# Altium schematic sheet 8_PCIeBank.SchDoc
size A; SheetNumber: 8; SheetTotal: 9
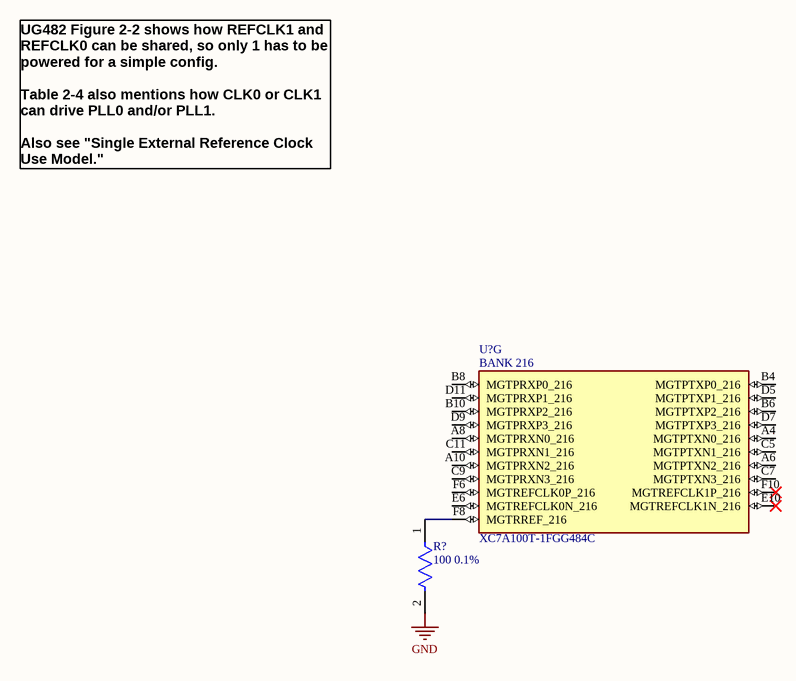
[diagram p0: 8_PCIeBank.SchDoc]

## Parts
R?  100 0.1%  [FP-ERA1A-IPC_B]
U?  XC7A100T-1FGG484C  [BGA484C100P22X22_2300X2300X260N]  (part G of 14)

## Nets
GND: R?.2
NetR?_1: R?.1 U?.F8(MGTRREF_216)

Not connected (* = marked no-connect by the designer): U? A4(MGTPTXN0_216) A6(MGTPTXN2_216) A8(MGTPRXN0_216) A10(MGTPRXN2_216) B4(MGTPTXP0_216) B6(MGTPTXP2_216) B8(MGTPRXP0_216) B10(MGTPRXP2_216) C5(MGTPTXN1_216) C7(MGTPTXN3_216) C9(MGTPRXN3_216) C11(MGTPRXN1_216) D5(MGTPTXP1_216) D7(MGTPTXP3_216) D9(MGTPRXP3_216) D11(MGTPRXP1_216) E6(MGTREFCLK0N_216) E10(MGTREFCLK1N_216)* F6(MGTREFCLK0P_216) F10(MGTREFCLK1P_216)*

## Notes on the sheet
- UG482 Figure 2-2 shows how REFCLK1 and REFCLK0 can be shared, so only 1 has to be powered for a simple config.
  Table 2-4 also mentions how CLK0 or CLK1 can drive PLL0 and/or PLL1.
  Also see "Single External Reference Clock Use Model."
- (in symbol XC7A100T-1FGG484C, part G) BANK 216

## Library data of the parts
R? = CMP-05422-000095-1: ERA-1AEB101C / RES SMD 100 OHM 0.1% 1/20W 0201; Max Power Dissipation: 50mW; Resistance: 100R; Temperature Coefficient: 25ppm/°C; Lead Free: Lead Free; Width: 0.012inch; Max Operating Temperature: 155°C; Features: Automotive AEC-Q200; Packaging: Tape and Reel; Length: 0.024inch; Number of Terminations: 2; Case Code (Imperial): 0201; Case/Package: 0201; Case Code (Metric): 0603; Tolerance: 0.1%; Min Operating Temperature: -55°C; Height: 0.009inch; Resistor Type: Thin Film
U? = XC7A100T-1FGG484C: Artix-7 Field Programmable Gate Array (FPGA) IC 285 4976640 101440 484-BBGA; MF: Xilinx Inc.; Value: *; Check_prices: https://www.snapeda.com/parts/XC7A100T-1FGG484C/Xilinx/view-part/?ref=eda; MP: XC7A100T-1FGG484C; SnapEDA_Link: https://www.snapeda.com/parts/XC7A100T-1FGG484C/Xilinx/view-part/?ref=snap; Package: FBGA-484 Xilinx